# Altium schematic sheet IMU.SchDoc
size A2 portrait; SheetNumber: 3; SheetTotal: 11
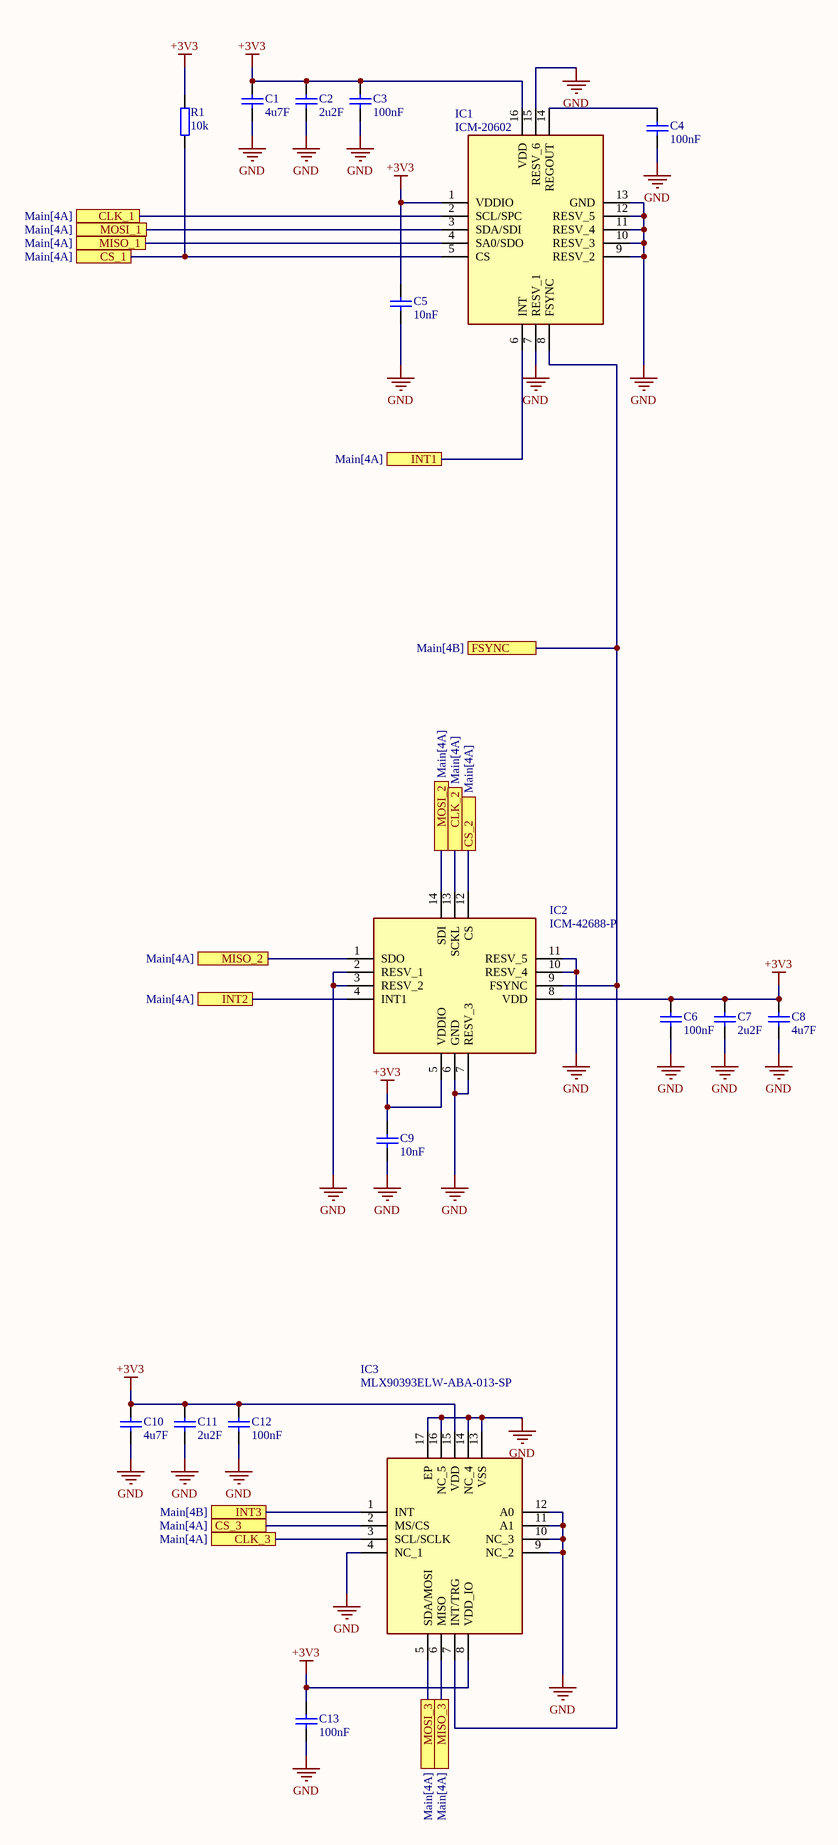
[diagram p0: IMU.SchDoc]

## Parts
C1  value 4u7F  [CAP0805]  (hidden comment: Cap0805)
C2  value 2u2F  [CAP0603]  (hidden comment: Cap0603)
C3  value 100nF  [CAP0402]  (hidden comment: Cap0402)
C4  value 100nF  [CAP0402]  (hidden comment: Cap0402)
C5  value 10nF  [CAP0402]  (hidden comment: Cap0402)
C6  value 100nF  [CAP0402]  (hidden comment: Cap0402)
C7  value 2u2F  [CAP0603]  (hidden comment: Cap0603)
C8  value 4u7F  [CAP0805]  (hidden comment: Cap0805)
C9  value 10nF  [CAP0402]  (hidden comment: Cap0402)
C10  value 4u7F  [CAP0805]  (hidden comment: Cap0805)
C11  value 2u2F  [CAP0603]  (hidden comment: Cap0603)
C12  value 100nF  [CAP0402]  (hidden comment: Cap0402)
C13  value 100nF  [CAP0402]  (hidden comment: Cap0402)
IC1  ICM-20602  [IAM20680HP]
IC2  ICM-42688-P  [IIM42352]
IC3  MLX90393ELW-ABA-013-SP  [QFN50P300X300X100-17N-D]
R1  value 10k  [RES0402]  (hidden comment: Res0402)

## Ports
CLK_1 (see Main[4A]), CLK_2 (see Main[4A]), CLK_3 (see Main[4A]), CS_1 (see Main[4A]), CS_2 (see Main[4A]), CS_3 (see Main[4A]), FSYNC (see Main[4B]), INT1 (see Main[4A]), INT2 (see Main[4A]), INT3 (see Main[4B]), MISO_1 (see Main[4A]), MISO_2 (see Main[4A]), MISO_3 (see Main[4A]), MOSI_1 (see Main[4A]), MOSI_2 (see Main[4A]), MOSI_3 (see Main[4A])

## Nets
+3V3: C1.2 C2.2 C3.2 C5.2 C6.2 C7.2 C8.2 C9.2 C10.2 C11.2 C12.2 C13.2 IC1.1(VDDIO) IC1.16(VDD) IC2.5(VDDIO) IC2.8(VDD) IC3.8(VDD_IO) IC3.15(VDD) R1.2
GND: C1.1 C2.1 C3.1 C4.1 C5.1 C6.1 C7.1 C8.1 C9.1 C10.1 C11.1 C12.1 C13.1 IC1.7(RESV_1) IC1.9(RESV_2) IC1.10(RESV_3) IC1.11(RESV_4) IC1.12(RESV_5) IC1.13(GND) IC1.15(RESV_6) IC2.2(RESV_1) IC2.3(RESV_2) IC2.6(GND) IC2.7(RESV_3) IC2.10(RESV_4) IC2.11(RESV_5) IC3.4(NC_1) IC3.9(NC_2) IC3.10(NC_3) IC3.11(A1) IC3.12(A0) IC3.13(VSS) IC3.14(NC_4) IC3.16(NC_5) IC3.17(EP)
CLK_1: IC1.2(SCL/SPC) ; port CLK_1
CLK_2: IC2.13(SCKL) ; port CLK_2
CLK_3: IC3.3(SCL/SCLK) ; port CLK_3
CS_1: IC1.5(CS) R1.1 ; port CS_1
CS_2: IC2.12(CS) ; port CS_2
CS_3: IC3.2(MS/CS) ; port CS_3
FSYNC: IC1.8(FSYNC) IC2.9(FSYNC) IC3.7(INT/TRG) ; port FSYNC
INT1: IC1.6(INT) ; port INT1
INT2: IC2.4(INT1) ; port INT2
INT3: IC3.1(INT) ; port INT3
MISO_1: IC1.4(SA0/SDO) ; port MISO_1
MISO_2: IC2.1(SDO) ; port MISO_2
MISO_3: IC3.6(MISO) ; port MISO_3
MOSI_1: IC1.3(SDA/SDI) ; port MOSI_1
MOSI_2: IC2.14(SDI) ; port MOSI_2
MOSI_3: IC3.5(SDA/MOSI) ; port MOSI_3
NetC4_2: C4.2 IC1.14(REGOUT)

## Library data of the parts
C1 C8 C10 = Cap0805: Voltage: 35V
C2 C7 C11 = Cap0603: Voltage: 50V
C3-C6 C9 C12 C13 = Cap0402: Voltage: 50V
IC1 = ICM-20602: Integrated Circuit; Manufacturer_Name: TDK; Datasheet Link: https://3cfeqx1hf82y3xcoull08ihx-wpengine.netdna-ssl.com/wp-content/uploads/2021/03/DS-000135-ICG-20660-TYP-v1.2.pdf; Manufacturer_Part_Number: ICM-20602; Mouser Part Number: 410-ICM-20602; Mouser Price/Stock: https://www.mouser.co.uk/ProductDetail/TDK-InvenSense/ICM-20602?qs=u4fy%2FsgLU9NtDChFbqTxBA%3D%3D; Arrow Part Number: ICM-20602; Arrow Price/Stock: https://www.arrow.com/en/products/icm-20602/invensense?utm_currency=USD&region=nac
IC2 = ICM-42688-P: Integrated Circuit; Manufacturer_Name: TDK; Datasheet Link: https://3cfeqx1hf82y3xcoull08ihx-wpengine.netdna-ssl.com/wp-content/uploads/2021/06/DS-000347-ICM-42688-P-v1.5.pdf; Manufacturer_Part_Number: ICM-42688-P; Mouser Part Number: 410-ICM-42688-P; Mouser Price/Stock: https://www.mouser.co.uk/ProductDetail/TDK-InvenSense/ICM-42688-P?qs=OlC7AqGiEDk8QrNAV728zw%3D%3D; Arrow Part Number: ICM-42688-P; Arrow Price/Stock: https://www.arrow.com/en/products/icm-42688-p/invensense?utm_currency=USD&region=nac
IC3 = MLX90393ELW-ABA-013-SP: Integrated Circuit; Manufacturer_Name: Melexis; Datasheet Link: https://www.melexis.com/-/media/files/documents/datasheets/mlx90393-datasheet-melexis.pdf; Height: 1mm; Manufacturer_Part_Number: MLX90393ELW-ABA-013-SP; Mouser Part Number: 482-90393ELWABA013SP; Mouser Price/Stock: https://www.mouser.co.uk/ProductDetail/Melexis/MLX90393ELW-ABA-013-SP?qs=4pzlT8jjbhe5W8hWOSw65g%3D%3D; Arrow Part Number: MLX90393ELW-ABA-013-SP; Arrow Price/Stock: https://www.arrow.com/en/products/mlx90393elw-aba-013-sp/melexis?utm_currency=USD&region=nac